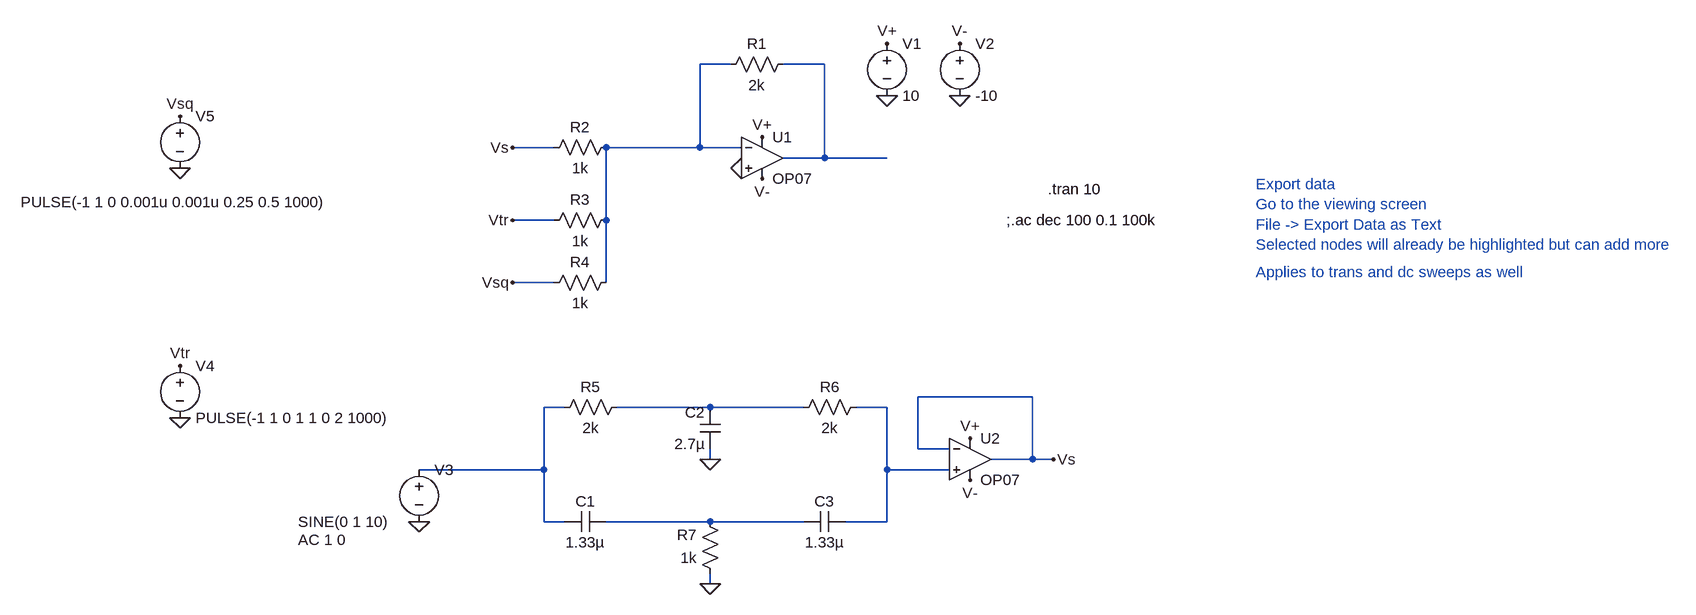
[diagram p0: schematic LTSPICE_Lesson9_ExportingData.asc]
LTSPICE_Lesson9_ExportingData.asc, the LTspice schematic file:
Version 4
SHEET 1 1896 692
WIRE 384 -128 336 -128
WIRE 528 -128 464 -128
WIRE 112 0 48 0
WIRE 336 0 336 -128
WIRE 336 0 192 0
WIRE 400 0 336 0
WIRE 528 16 528 -128
WIRE 528 16 464 16
WIRE 624 16 528 16
WIRE 112 112 48 112
WIRE 192 112 192 0
WIRE 112 208 48 208
WIRE 192 208 192 112
WIRE 848 384 672 384
WIRE 128 400 96 400
WIRE 352 400 208 400
WIRE 496 400 352 400
WIRE 624 400 576 400
WIRE 672 464 672 384
WIRE 720 464 672 464
WIRE 352 480 352 464
WIRE 848 480 848 384
WIRE 848 480 784 480
WIRE 880 480 848 480
WIRE 96 496 96 400
WIRE 96 496 -96 496
WIRE 624 496 624 400
WIRE 720 496 624 496
WIRE 96 576 96 496
WIRE 128 576 96 576
WIRE 352 576 192 576
WIRE 496 576 352 576
WIRE 624 576 624 496
WIRE 624 576 560 576
WIRE 352 672 352 656
FLAG 400 32 0
FLAG 736 -80 0
FLAG 624 -80 0
FLAG 624 -160 V+
FLAG 432 -16 V+
FLAG 432 48 V-
FLAG 736 -160 V-
FLAG -96 576 0
FLAG -464 416 0
FLAG -464 32 0
FLAG -464 336 Vtr
FLAG 48 0 Vs
FLAG 48 112 Vtr
FLAG -464 -48 Vsq
FLAG 48 208 Vsq
FLAG 352 672 0
FLAG 352 480 0
FLAG 752 448 V+
FLAG 752 512 V-
FLAG 880 480 Vs
SYMBOL OpAmps\\OP07 432 -48 R0
SYMATTR InstName U1
SYMBOL res 480 -144 R90
WINDOW 0 0 56 VBottom 2
WINDOW 3 32 56 VTop 2
SYMATTR InstName R1
SYMATTR Value 2k
SYMBOL res 208 -16 R90
WINDOW 0 0 56 VBottom 2
WINDOW 3 32 56 VTop 2
SYMATTR InstName R2
SYMATTR Value 1k
SYMBOL res 208 96 R90
WINDOW 0 0 56 VBottom 2
WINDOW 3 32 56 VTop 2
SYMATTR InstName R3
SYMATTR Value 1k
SYMBOL res 208 192 R90
WINDOW 0 0 56 VBottom 2
WINDOW 3 32 56 VTop 2
SYMATTR InstName R4
SYMATTR Value 1k
SYMBOL voltage 624 -176 R0
WINDOW 123 0 0 Left 0
WINDOW 39 0 0 Left 0
SYMATTR InstName V1
SYMATTR Value 10
SYMBOL voltage 736 -176 R0
WINDOW 123 0 0 Left 0
WINDOW 39 0 0 Left 0
SYMATTR InstName V2
SYMATTR Value -10
SYMBOL voltage -96 480 R0
WINDOW 123 -186 124 Left 2
WINDOW 39 0 0 Left 0
WINDOW 3 -186 96 Left 2
SYMATTR Value2 AC 1 0
SYMATTR Value SINE(0 1 10)
SYMATTR InstName V3
SYMBOL voltage -464 320 R0
WINDOW 123 0 0 Left 0
WINDOW 39 0 0 Left 0
SYMATTR InstName V4
SYMATTR Value PULSE(-1 1 0 1 1 0 2 1000)
SYMBOL voltage -464 -64 R0
WINDOW 3 -245 148 Left 2
WINDOW 123 0 0 Left 0
WINDOW 39 0 0 Left 0
SYMATTR Value PULSE(-1 1 0 0.001u 0.001u 0.25 0.5 1000)
SYMATTR InstName V5
SYMBOL res 224 384 R90
WINDOW 0 0 56 VBottom 2
WINDOW 3 32 56 VTop 2
SYMATTR InstName R5
SYMATTR Value 2k
SYMBOL res 592 384 R90
WINDOW 0 0 56 VBottom 2
WINDOW 3 32 56 VTop 2
SYMATTR InstName R6
SYMATTR Value 2k
SYMBOL res 368 672 R180
WINDOW 0 36 76 Left 2
WINDOW 3 36 40 Left 2
SYMATTR InstName R7
SYMATTR Value 1k
SYMBOL cap 192 560 R90
WINDOW 0 0 32 VBottom 2
WINDOW 3 32 32 VTop 2
SYMATTR InstName C1
SYMATTR Value 1.33µ
SYMBOL cap 368 464 R180
WINDOW 0 24 56 Left 2
WINDOW 3 24 8 Left 2
SYMATTR InstName C2
SYMATTR Value 2.7µ
SYMBOL cap 496 592 R270
WINDOW 0 32 32 VTop 2
WINDOW 3 0 32 VBottom 2
SYMATTR InstName C3
SYMATTR Value 1.33µ
SYMBOL OpAmps\\OP07 752 416 R0
SYMATTR InstName U2
TEXT 872 64 Left 2 !.tran 10
TEXT 808 112 Left 2 !;.ac dec 100 0.1 100k
TEXT 1192 56 Left 2 ;Export data\nGo to the viewing screen\nFile -> Export Data as Text\nSelected nodes will already be highlighted but can add more
TEXT 1192 192 Left 2 ;Applies to trans and dc sweeps as well

The netlist it stands for:
* LTSPICE_Lesson9_ExportingData.asc
XU1 0 N001 V+ V- N002 LT1001  ; OP07, pins In+ In- V+ V- OUT
R1 N002 N001 2k
R2 N001 Vs 1k
R3 N001 Vtr 1k
R4 N001 Vsq 1k
V1 V+ 0 10
V2 V- 0 -10
V3 N003 0 SINE(0 1 10) AC 1 0
V4 Vtr 0 PULSE(-1 1 0 1 1 0 2 1000)
V5 Vsq 0 PULSE(-1 1 0 0.001u 0.001u 0.25 0.5 1000)
R5 N004 N003 2k
R6 N005 N004 2k
R7 0 N006 1k
C1 N006 N003 1.33µ
C2 0 N004 2.7µ
C3 N006 N005 1.33µ
XU2 N005 Vs V+ V- Vs LT1001  ; OP07, pins In+ In- V+ V- OUT
.tran 10
;.ac dec 100 0.1 100k
* Export data
* Go to the viewing screen
* File -> Export Data as Text
* Selected nodes will already be highlighted but can add more
* Applies to trans and dc sweeps as well
.lib LTC.lib
.backanno
.end